# Altium schematic sheet sensors.SchDoc: Sensors
size A4; DocumentNumber: 2; SheetNumber: 2; SheetTotal: 3
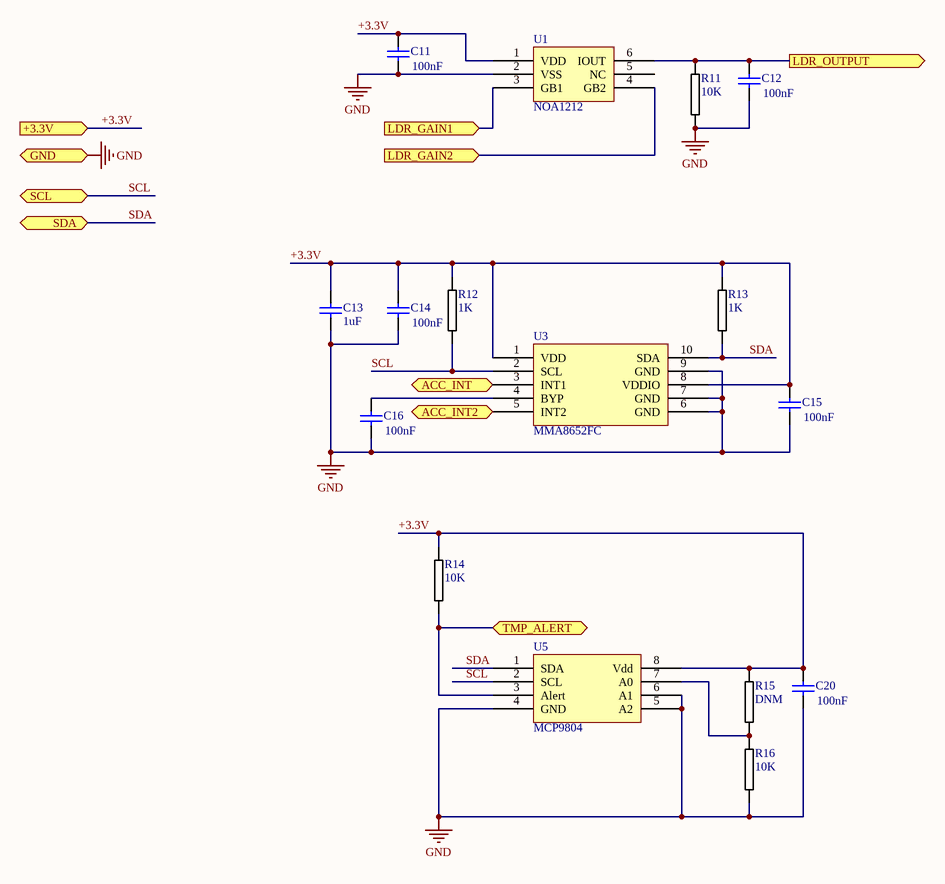
[diagram p0: sensors.SchDoc]

## Parts
C11  100nF  [0402C-TBD]
C12  100nF  [0402C-TBD]
C13  1uF  [C0805]
C14  100nF  [0402C-TBD]
C15  100nF  [0402C-TBD]
C16  100nF  [0402C-TBD]
C20  100nF  [0402C-TBD]
R11  10K  [0402R-GENERIC]
R12  1K  [0402R-GENERIC]
R13  1K  [0402R-GENERIC]
R14  10K  [0402R-GENERIC]
R15  DNM  [0402R-GENERIC]
R16  10K  [0402R-GENERIC]
U1  NOA1212  [NOA1212]
U3  MMA8652FC  [DFN10]
U5  MCP9804  [MSOP-MS8_N]

## Ports
+3.3V (in), ACC_INT2 (out), ACC_INT (out), GND (bidir), LDR_GAIN1 (in), LDR_GAIN2 (in), LDR_OUTPUT (out), SCL, SDA, TMP_ALERT

## Nets
GND: C11.1 C12.1 C13.1 C14.1 C15.1 C16.1 C20.1 R11.1 R16.1 U1.2(VSS) U3.6(GND) U3.7(GND) U3.9(GND) U5.4(GND) U5.5(A2) U5.6(A1) ; port GND
+3.3V: C11.2 C13.2 C14.2 C15.2 C20.2 R12.2 R13.2 R14.2 R15.2 U1.1(VDD) U3.1(VDD) U3.8(VDDIO) U5.8(Vdd) ; port +3.3V
ACC_INT: U3.3(INT1) ; port ACC_INT
ACC_INT2: U3.5(INT2) ; port ACC_INT2
LDR_GAIN1: U1.3(GB1) ; port LDR_GAIN1
LDR_GAIN2: U1.4(GB2) ; port LDR_GAIN2
LDR_OUTPUT: C12.2 R11.2 U1.6(IOUT) ; port LDR_OUTPUT
SCL: R12.1 U3.2(SCL) U5.2(SCL) ; port SCL
SDA: R13.1 U3.10(SDA) U5.1(SDA) ; port SDA
TMP_ALERT: R14.1 U5.3(Alert) ; port TMP_ALERT
NetC16_2: C16.2 U3.4(BYP)
NetR15_1: R15.1 R16.2 U5.7(A0)

Not connected (* = marked no-connect by the designer): U1 5(NC)

## Notes on the sheet
- Title
- Size:
- Date:
- A4
- Number:
- Time:
- Revision:
- Sheet
- of
- The Things Products
- Project:
- File:

## Library data of the parts
C11 C12 C14-C16 C20 = Cap: Capacitor, X7R
C13 = Cap: Capacitor
R11-R16 = 0402R-GENERIC: RESISTOR 0402 GENERIC